# EAGLE design ohmHandle4seg_V123D_noISPV2 (EAGLE 7.5.0)
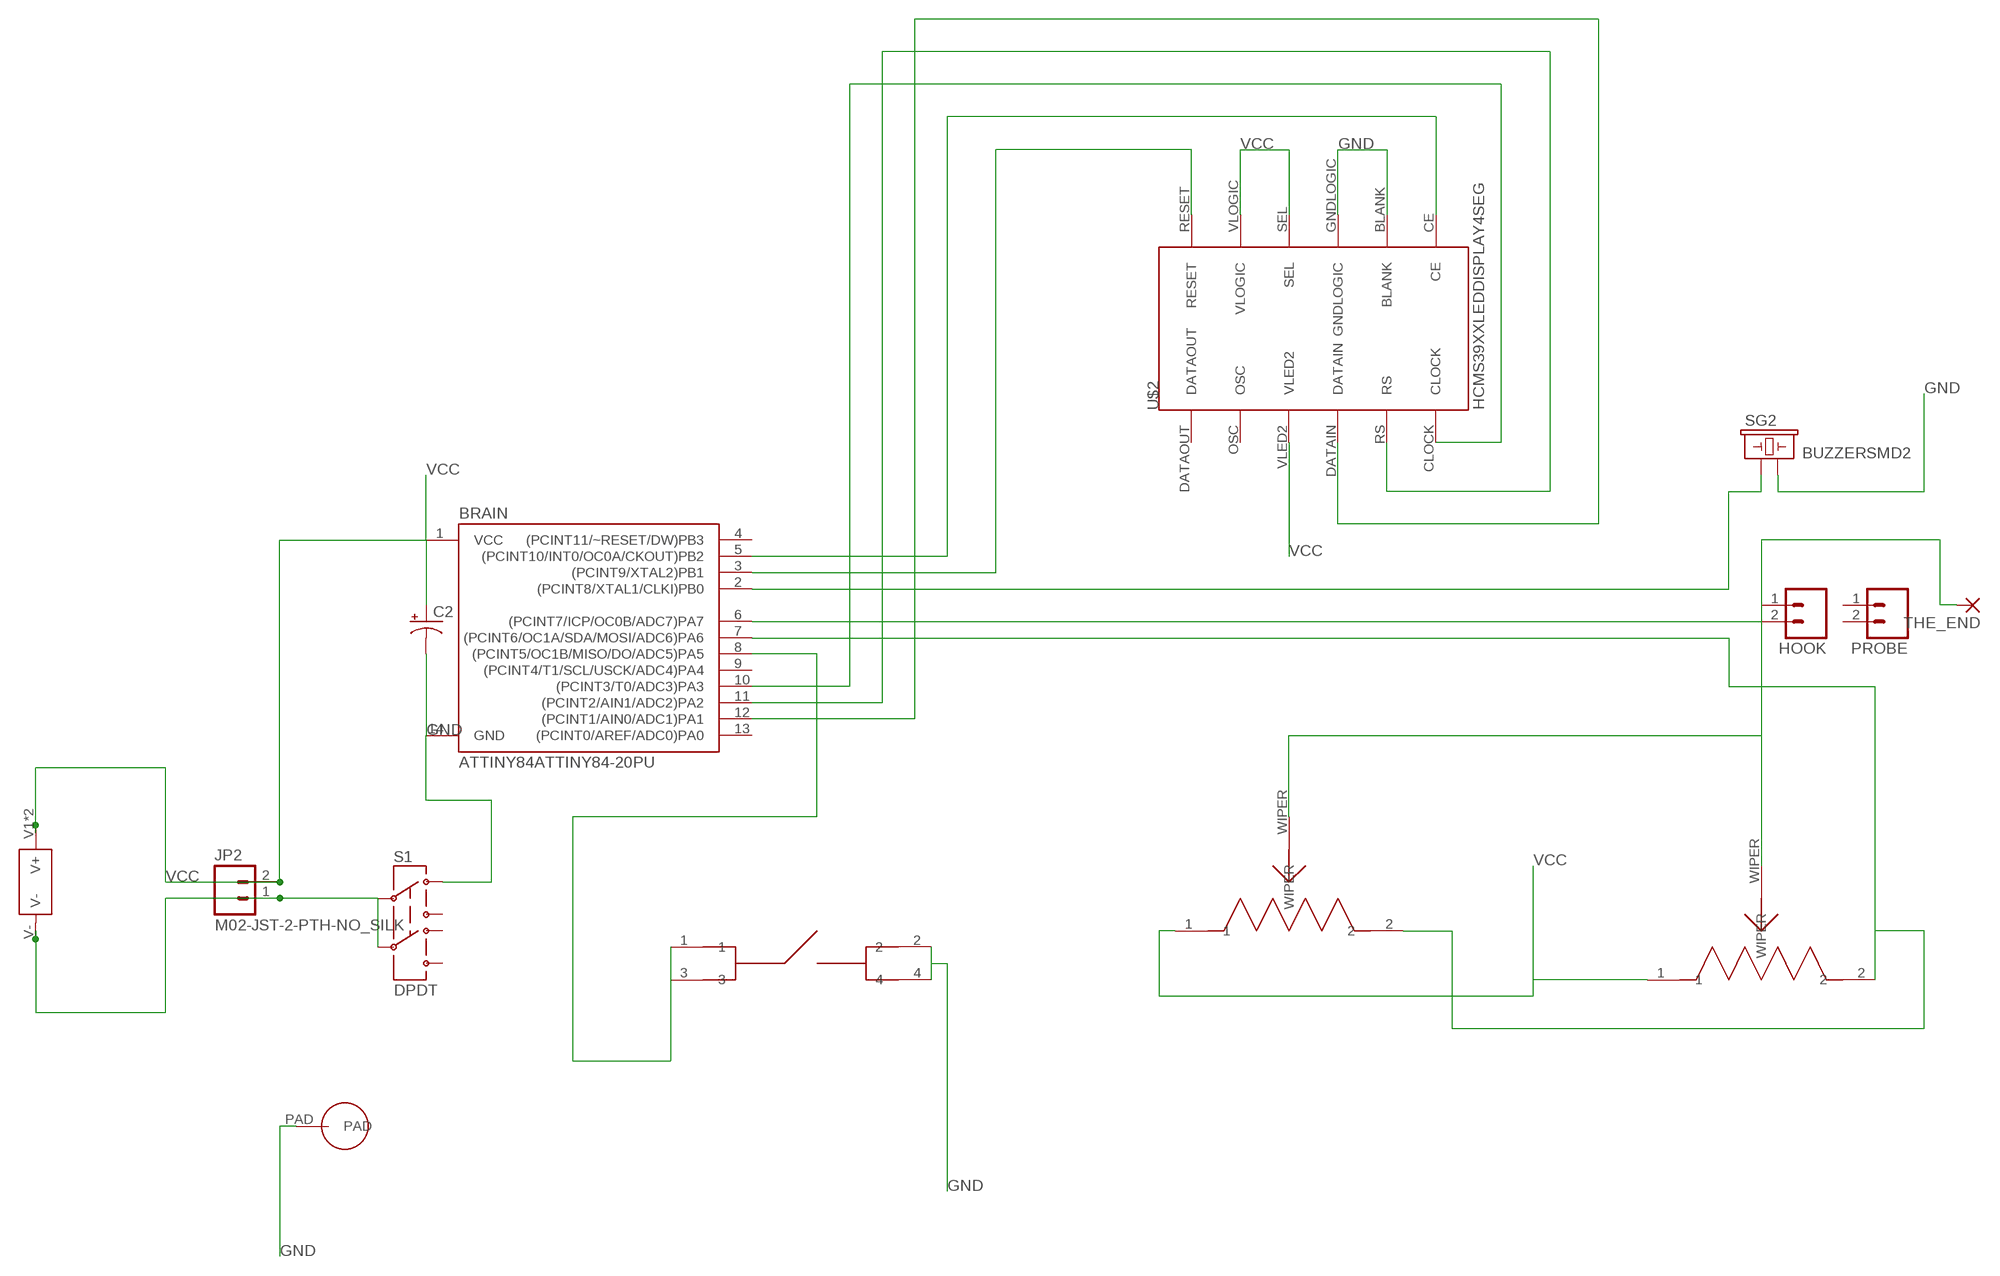
[diagram p0: schematic, sheet 1]

## Parts
BRAIN  ATTINY84ATTINY84-20PU  [DIL14]
C2  CAP_POLPTH2  [CPOL-RADIAL-10UF-25V]
HOOK  M02LOCK_LONGPADS  [1X02_LOCK_LONGPADS]
J1  HOLDER-BAT-D20.32  [2032-SMD-D20.32]
JP2  M02-JST-2-PTH-NO_SILK  [JST-2-PTH-NS]
PROBE  M02LOCK_LONGPADS  [1X02_LOCK_LONGPADS]
S1  DPDT  SWITCH-DPDTAYZ0202  [AYZ0202]
SG2  BUZZERSMD2  [BUZZER-CCV]
THE_END  SMD5  [SMD2,54-5,08]
U$2  HCMS39XXLEDDISPLAY4SEG  [LEDDISPLAY4SEG]
U$3  THUMBPOT10MM  [THUMBPOT10MM]
U$6  LARGEPAD  [LARGEPAD]
U$7  THUMBPOT3352  [THUMBPOT3352P]
U$9  BUTTONSMD  [TACTILESWITCHSMD]

## Nets
GND: BRAIN.14(GND) C2.2(-) S1.1 SG2.- U$2.BLANK U$2.GNDLOGIC U$6.PAD U$9.2 U$9.4
N$1: BRAIN.3((PCINT9/XTAL2)PB1) U$2.RESET
N$2: BRAIN.11((PCINT2/AIN1/ADC2)PA2) U$2.RS
N$3: BRAIN.12((PCINT1/AIN0/ADC1)PA1) U$2.DATAIN
N$4: BRAIN.8((PCINT5/OC1B/MISO/DO/ADC5)PA5) U$9.1 U$9.3
N$5: J1.V- JP2.1 S1.2 S1.5
N$6: BRAIN.7((PCINT6/OC1A/SDA/MOSI/ADC6)PA6) U$3.2 U$7.2
N$9: BRAIN.5((PCINT10/INT0/OC0A/CKOUT)PB2) U$2.CE
N$11: BRAIN.10((PCINT3/T0/ADC3)PA3) U$2.CLOCK
N$12: BRAIN.2((PCINT8/XTAL1/CLKI)PB0) SG2.+
THE_END: BRAIN.6((PCINT7/ICP/OC0B/ADC7)PA7) HOOK.1 HOOK.2 THE_END.1(P) U$3.WIPER U$7.WIPER
VCC: BRAIN.1(VCC) C2.1(+) J1.V1(V+) J1.V2(V+) JP2.2 U$2.SEL U$2.VLED2 U$2.VLOGIC U$3.1 U$7.1
Unconnected: BRAIN.4((PCINT11/~RESET/DW)PB3) BRAIN.9((PCINT4/T1/SCL/USCK/ADC4)PA4) BRAIN.13((PCINT0/AREF/ADC0)PA0) PROBE.1 PROBE.2 S1.3 S1.4 S1.6 U$2.DATAOUT U$2.OSC

## Library data of the parts
BRAIN = SparkFun-DigitalIC:ATTINY84: Atmel 14-pin 2/4/8kB flash uC
C2 = SparkFun-Passives:CAP_POL: Capacitor Polarized These are standard SMD and PTH capacitors. Normally 10uF, 47uF, and 100uF in electrolytic and tantalum varieties. Always verify the external diameter of the through hole cap, it varies with capacity, voltage, and manufacturer. The EIA devices should be standard.
HOOK JP2 PROBE = SparkFun-Connectors:M02: Standard 2-pin 0.1" header. Use with - straight break away headers ( PRT-00116) - right angle break away headers (PRT-00553) - swiss pins (PRT-00743) - machine pins (PRT-00117) - female headers (PRT-00115) Molex polarized connector foot print use with: PRT-08233 with associated crimp pins and housings. 2.54_SCREWTERM for use with PRT-10571. 3.5mm Screw Terminal footprints for PRT-08084 5mm Screw Terminal footprints for use with PRT-08432
J1 = HOLDER-BAT:HOLDER-BAT
S1 = hannahPier9:SWITCH-DPDT: DPDT Version of the COM-00597; PROD_ID: SWCH-08179
SG2 = hannahPier9:BUZZER: Buzzer 12mm Spark Fun Electronics SKU : Comp-Buzzer
THE_END = wirepad:SMD5: SMD PAD
U$2 = hannahPier9:HCMS39XXLEDDISPLAY4SEG
U$3 = hannahPier9:THUMBPOT10MM
U$6 = hannahPier9:LARGEPAD
U$7 = hannahPier9:THUMBPOT3352
U$9 = hannahPier9:BUTTONSMD

## Board
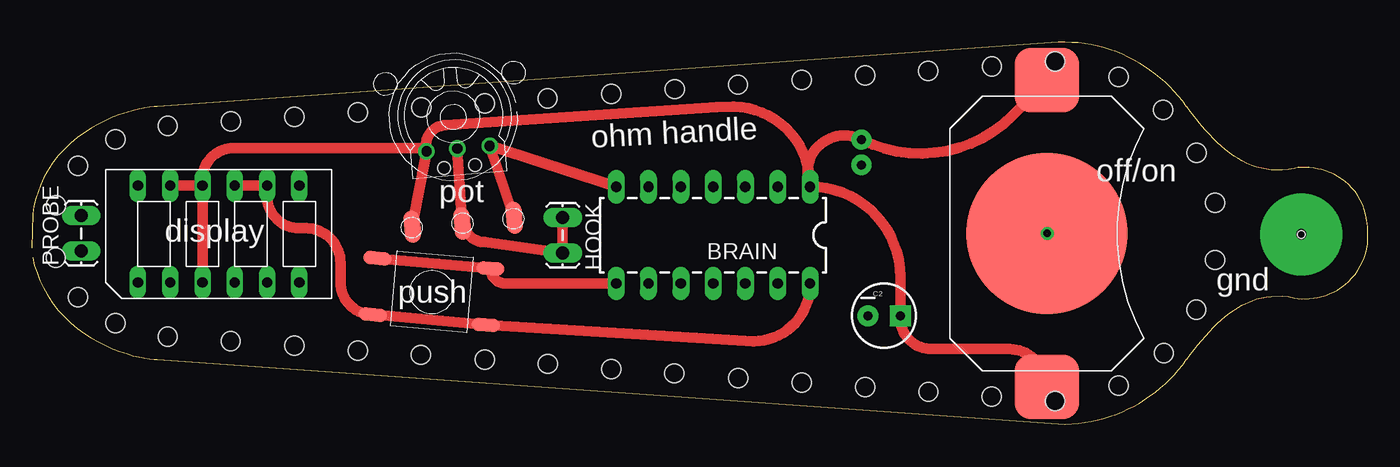
[diagram p1: board, top side]
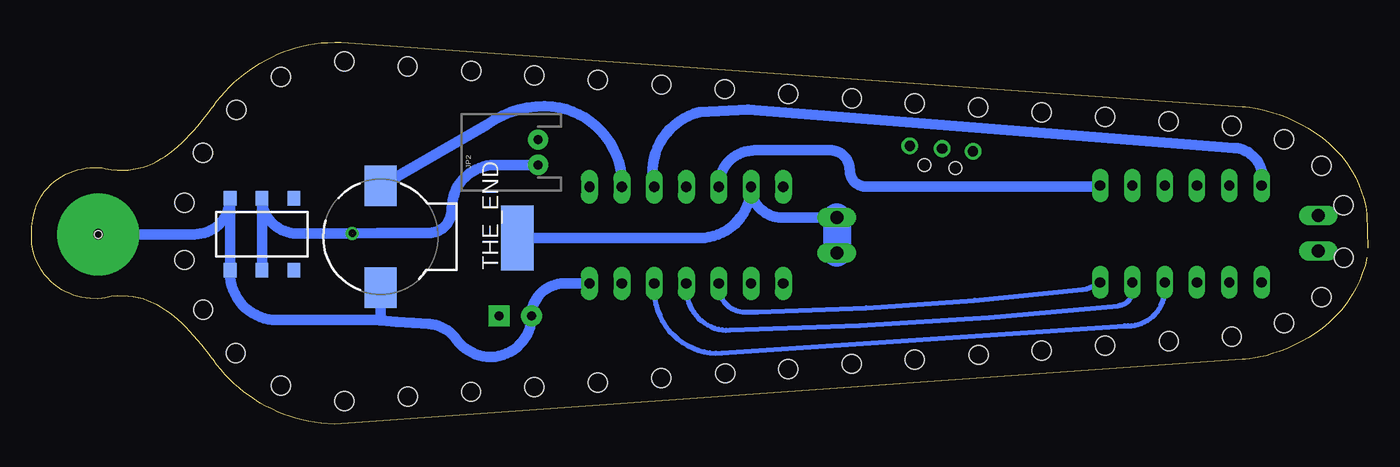
[diagram p2: board, bottom side, seen from below]

Size 105.07 x 30.06 mm. Coordinates in mm from the lower left corner, seen from the top.
Copper layers (1*16): Top 0.035mm / dielectric 1.5mm / Bottom 0.035mm
Design rules "default": minimum track width 10mil, minimum drill 24mil, track to track 8mil, track to pad 8mil, pad to pad 8mil, via to via 8mil, smd to smd 8mil, copper to edge 40mil, drill to drill 8mil, minimum pad ring 10mil, minimum via ring 8mil, stop-mask expansion 4mil, vias tented up to drill 0mil, thermal gap 10mil

### Footprints (pad centres in the part's own frame; a part is rotated, then mirrored left to right if it is on the bottom)
DIL14 = drill 0.813 long: 1 -8.89,-3.81; 2 -6.35,-3.81; 3 -3.81,-3.81; 4 -1.27,-3.81; 5 1.27,-3.81; 6 3.81,-3.81; 7 6.35,-3.81; 8 6.35,3.81; 9 3.81,3.81; 10 1.27,3.81; 11 -1.27,3.81; 12 -3.81,3.81; 13 -6.35,3.81; 14 -8.89,3.81
CPOL-RADIAL-10UF-25V = drill 0.7 pad 1.651 square: 1 1.27,0 | drill 0.7 pad 1.651: 2 -1.27,0
1X02_LOCK_LONGPADS = drill 1.016 long: 1 -0.127,0; 2 2.667,0
2032-SMD-D20.32 = smd 5.08 x 5.08: V1 -12.065,0; V2 12.065,0 | smd 12.7 x 12.7: V- 0,0
JST-2-PTH-NS = drill 0.7 pad 1.6: 1 -1,0; 2 1,0
AYZ0202 = smd 1 x 1.15: 1 -2.5,2.825; 2 0,2.825; 3 2.5,2.825; 4 -2.5,-2.825; 5 0,-2.825; 6 2.5,-2.825
BUZZER-CCV = smd 3.2 x 2.5: + 4,0; - -4,0
SMD2,54-5,08 = smd 2.54 x 5.08: 1 0,0
OUTLINE4 = hole 1.5: 6.921,22.39; 11.036,23.444; 16.019,23.818; 21.018,24.175; 26.001,24.532; 30.985,24.921; 35.983,25.227; 40.919,25.615; 45.937,25.962; 50.915,26.349; 55.892,26.696; 60.908,27.081; 65.887,27.421; 70.861,27.786; 75.857,28.133; 80.832,28.521; 85.828,27.297; 89.335,24.726; 91.957,21.322; 93.402,17.394; 93.412,12.902; 91.943,8.982; 89.38,5.562; 85.829,3.011; 80.845,1.803; 75.849,2.16; 70.866,2.53; 65.891,2.893; 60.9,3.259; 55.916,3.613; 50.89,3.98; 45.922,4.322; 40.945,4.722; 35.97,5.057; 30.942,5.436; 25.989,5.779; 20.994,6.149; 15.995,6.518; 11.037,6.873; 6.938,7.944; 3.979,9.968; 2.238,13.092; 2.255,17.214; 3.982,20.318
LEDDISPLAY4SEG = drill 0.8 long: BLANK -8.89,2.54; CE -6.35,2.54; CLOCK -6.35,-5.08; DATAIN -11.43,-5.08; DATAOUT -19.05,-5.08; GNDLOGIC -11.43,2.54; OSC -16.51,-5.08; RESET -19.05,2.54; RS -8.89,-5.08; SEL -13.97,2.54; VLED2 -13.97,-5.08; VLOGIC -16.51,2.54
THUMBPOT10MM = smd 1.27 x 2.54: 1 -3.886,-8.328; 2 4.159,-8.317; WIPER 0.047,-8.418
LARGEPAD = drill 0.8 pad 6.452: PAD 0,0 | hole 0.6: 0,0
THUMBPOT3352P = drill 0.8: 1 5.846,8.954; 2 10.836,8.959; WIPER 8.277,8.965 | hole 1: 7.126,7.538; 9.578,7.559
TACTILESWITCHSMD = smd 1.067 x 2.184: 1 4.894,11.806; 2 9.345,11.826; 3 4.874,2.866; 4 9.325,2.906

### Placement (x,y rotation side)
BRAIN  52.31,14.87 180 top
C2  67.03,8.53 0 top
HOOK  41.76,16.13 270 top
J1  79.83,15 90 top
JP2  65.25,21.39 90 bottom
PROBE  3.89,13.73 90 top
S1  86.96,14.94 0 bottom
SG2  77.64,14.74 90 bottom
THE_END  66.87,14.64 0 bottom
U$1  [OUTLINE4]  -0.35,0.01 0 top
U$2  27.39,16.23 0 top
U$3  33.07,24.17 5 top
U$6  99.85,14.93 0 top
U$7  26,12.03 5 top
U$9  24.75,18.15 265 top

### Tracks (layer width: path | path; a pad name or v marks a point on that pad's centre or on a via)
GND
  Top 0.813: U$2.GNDLOGIC U$2.BLANK 18.5,17.94 arc90 21.02,15.42 21.56,15.42 arc-90 24.28,12.7 24.28,11.16 arc90 U$9.4 U$9.2 56.76,6.52 arc90 61.2,10.96 BRAIN.14
  Bottom 0.813: BRAIN.14 63.22,11.06 arc-90 C2.2 arc144 71.64,6.64 arc-50 73.82,7.87 arc0 77.64,8.15 | 77.64,8.14 arc90 77.64,8.15 | 77.64,8.15 SG2.- | U$6.PAD arc-90 U$6.PAD 92.29,14.93 arc-90 S1.1 arc-90 89.48,17.74 89.48,11.89 arc-90 85.76,8.18 77.67,8.18 arc90 77.64,8.15
N$1
  Bottom 0.813: BRAIN.3 arc90 52.55,24.54 48.73,24.75 10.51,21.73 arc101 U$2.RESET
N$2
  Bottom 0.406: 18.5,10.59 arc90 19.61,9.31 arc5 50.16,7.39 arc90 53.58,10.46
  Bottom 0.813: U$2.RS 18.5,10.59 | BRAIN.11 53.58,10.46
N$3
  Bottom 0.406: 56.12,10.3 arc-90 50.81,5.59 19.11,7.74 arc-90 15.96,10.33
  Bottom 0.813: BRAIN.12 56.12,10.3 | 15.96,10.33 U$2.DATAIN
N$4
  Top 0.813: U$9.3 U$9.1 arc90 37.27,11.06 BRAIN.8
N$5  (1 unrouted)
  Bottom 0.813: JP2.1 68.61,20.39 arc-90 72.04,16.96 72.04,16.85 arc90 73.86,15.03 arc-1 J1.V- | J1.V- arc90 79.8,15.03 arc-90 J1.V- | J1.V- 84.2,15 arc90 S1.2 S1.5
N$6
  Top 0.813: BRAIN.7 U$7.2 U$3.2
N$8  (via drill 0.6)
  other vias: 79.86,15.01
N$9
  Bottom 0.813: U$2.CE arc90 21.14,18.67 39.43,18.67 arc90 40.74,19.98 arc-90 42.31,21.55 48.17,21.55 arc-90 BRAIN.5
N$11
  Bottom 0.406: BRAIN.10 arc-90 49.16,8.82 47.98,8.82 arc-5 22.41,10.58 arc-23 U$2.CLOCK
N$12
  Bottom 0.813: BRAIN.2 58.66,18.94 arc-90 64.73,25.01 arc-35 69.25,23.58 SG2.+
THE_END
  Top 0.813: U$7.WIPER U$3.WIPER 33.98,15.96 arc90 35.63,14.32 HOOK.2 | HOOK.1 41.75,13.48
  Bottom 0.813: HOOK.1 46.08,16.26 arc90 BRAIN.6 arc90 52.54,14.64 THE_END.1
  Bottom 2.184: HOOK.1 HOOK.2
VCC
  Top 0.813: U$2.VLOGIC U$2.SEL | U$2.SEL U$2.VLED2 | BRAIN.1 arc-90 68.3,11.58 C2.1 68.3,8.37 arc90 70.77,5.9 76.87,5.9 arc-90 J1.V1 | U$2.SEL 13.42,19.28 arc-90 15.91,21.73 30.96,21.73 arc90 U$7.1 | BRAIN.1 arc90 55.19,24.99 53.83,24.96 32.56,23.52 arc90 31.01,21.97 U$7.1 | U$3.1 U$7.1 | J1.V2 79.83,26.99 77.13,24.29 arc-72 JP2.2 arc139 BRAIN.1

### Text on the board
tNames: ohm handle | off/on | pot | display | gnd | push